# Altium schematic sheet WT2_Screen.SchDoc
size A4
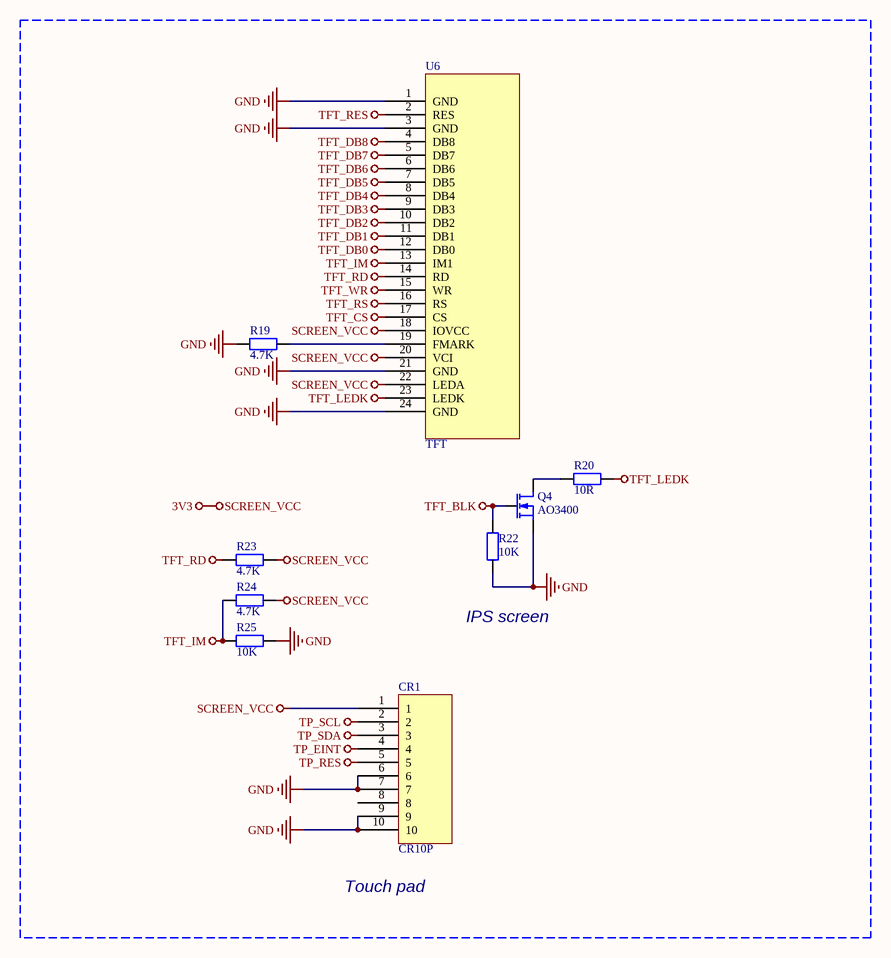
[diagram p0: WT2_Screen.SchDoc]

## Parts
CR1  CR10P  [CONN RCPT 10POS 0.4MM]
Q4  AO3400  [MOS_SOT-23]
R19  4.7K  [电阻_R0402]
R20  10R  [电阻_R0402]
R22  10K  [电阻_R0402]
R23  4.7K  [电阻_R0402]
R24  4.7K  [电阻_R0402]
R25  10K  [电阻_R0402]
U6  TFT  [CONN-SMD_DF37NC-24DS-0.4V(51)]

## Nets
3V3: CR1.1 R23.2 R24.2 U6.18(IOVCC) U6.20(VCI) U6.22(LEDA)  [also labelled SCREEN_VCC]
GND: CR1.6 CR1.7 CR1.9 CR1.10 Q4.3(S) R19.1 R22.1 R25.1 U6.1(GND) U6.3(GND) U6.21(GND) U6.24(GND)
TFT_BLK: Q4.1(G) R22.2
TFT_CS: U6.17(CS)
TFT_DB0: U6.12(DB0)
TFT_DB1: U6.11(DB1)
TFT_DB2: U6.10(DB2)
TFT_DB3: U6.9(DB3)
TFT_DB4: U6.8(DB4)
TFT_DB5: U6.7(DB5)
TFT_DB6: U6.6(DB6)
TFT_DB7: U6.5(DB7)
TFT_DB8: U6.4(DB8)
TFT_IM: R24.1 R25.2 U6.13(IM1)
TFT_LEDK: R20.2 U6.23(LEDK)
TFT_RD: R23.1 U6.14(RD)
TFT_RES: U6.2(RES)
TFT_RS: U6.16(RS)
TFT_WR: U6.15(WR)
TP_EINT: CR1.4
TP_RES: CR1.5
TP_SCL: CR1.2
TP_SDA: CR1.3
NetQ4_2: Q4.2(D) R20.1
NetR19_2: R19.2 U6.19(FMARK)

Not connected (* = marked no-connect by the designer): CR1 8

## Notes on the sheet
- (near R22) IPS screen
- (near CR1) Touch pad

## Library data of the parts
CR1 = CONN RCPT 10P: 板对板连接器
Q4 = MOSFET-N: _Comma: ,; _Current: 150A; _Footprint: DFN5*6; _Name: N-MOSFET; _Specification: N-MOSFET,AO3400,DFN5*6,150A,30V; _Voltage: 30V; _Model: AO3400
R19 R23 R24 = Res: _Accuracy: 1%; _Power: 1/8W; _Footprint: 0805; _Drift: 100ppm; _Comma: ,; _Specification: Res,0805,4.7K,1%,1/8W,100ppm; _Name: Res; _Value: 4.7K
R20 = Res: _Accuracy: 1%; _Power: 1/8W; _Footprint: 0805; _Drift: 100ppm; _Comma: ,; _Specification: Res,0805,10R,1%,1/8W,100ppm; _Name: Res; _Value: 10R
R22 R25 = Res: _Accuracy: 1%; _Power: 1/8W; _Footprint: 0805; _Drift: 100ppm; _Comma: ,; _Specification: Res,0805,10K,1%,1/8W,100ppm; _Name: Res; _Value: 10K
U6 = TFT_IPS_8Bit_1.54_240*240